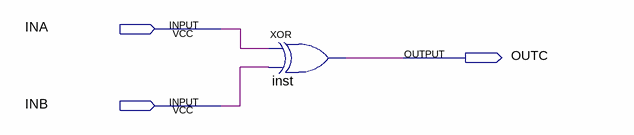
[diagram p0: schematic sheet]
// Quartus schematic Compuerta_XOR.bdf as structural Verilog: 1 symbols, 3 pins
module Compuerta_XOR (
  input  INA,
  input  INB,
  output OUTC
);

  xor inst (OUTC, INA, INB);
endmodule
